# Altium schematic sheet _camera.SchDoc
size Tabloid
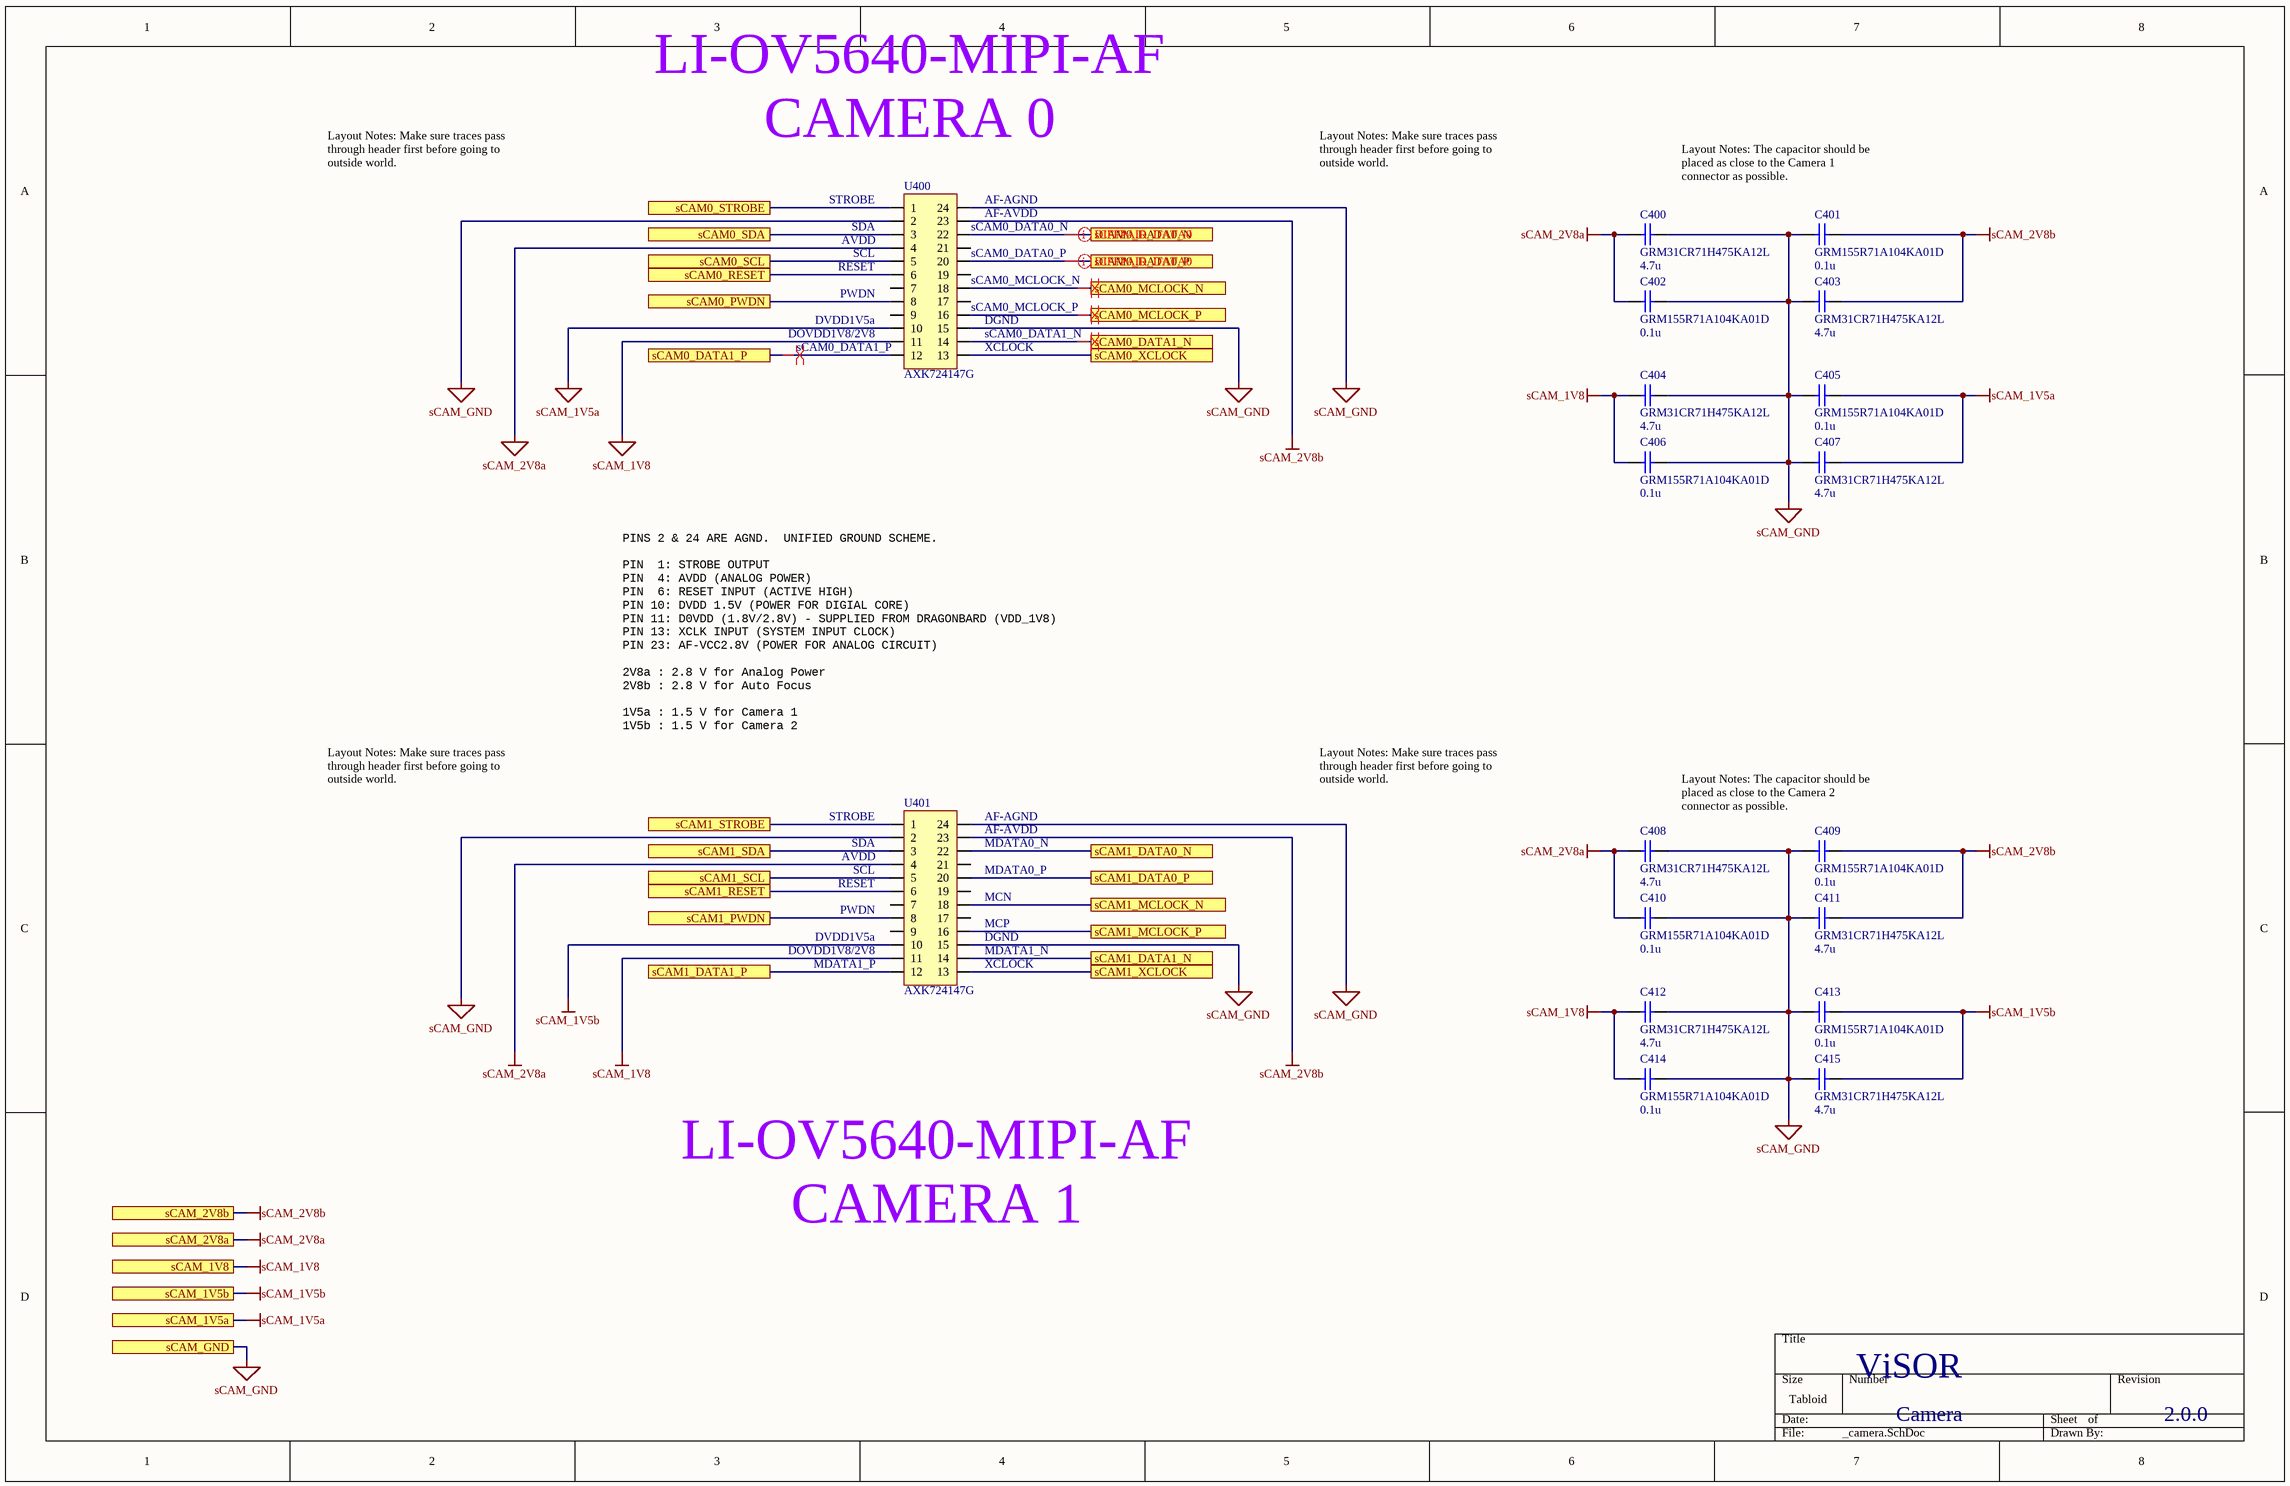
[diagram p0: _camera.SchDoc]

## Parts
C400  GRM31CR71H475KA12L  value 4.7u  [1206]
C401  GRM155R71A104KA01D  value 0.1u  [0402]
C402  GRM155R71A104KA01D  value 0.1u  [0402]
C403  GRM31CR71H475KA12L  value 4.7u  [1206]
C404  GRM31CR71H475KA12L  value 4.7u  [1206]
C405  GRM155R71A104KA01D  value 0.1u  [0402]
C406  GRM155R71A104KA01D  value 0.1u  [0402]
C407  GRM31CR71H475KA12L  value 4.7u  [1206]
C408  GRM31CR71H475KA12L  value 4.7u  [1206]
C409  GRM155R71A104KA01D  value 0.1u  [0402]
C410  GRM155R71A104KA01D  value 0.1u  [0402]
C411  GRM31CR71H475KA12L  value 4.7u  [1206]
C412  GRM31CR71H475KA12L  value 4.7u  [1206]
C413  GRM155R71A104KA01D  value 0.1u  [0402]
C414  GRM155R71A104KA01D  value 0.1u  [0402]
C415  GRM31CR71H475KA12L  value 4.7u  [1206]
U400  AXK724147G  [AXK724147G]
U401  AXK724147G  [AXK724147G]

## Ports
sCAM0_DATA0_N, sCAM0_DATA0_P, sCAM0_DATA1_N, sCAM0_DATA1_P, sCAM0_MCLOCK_N, sCAM0_MCLOCK_P, sCAM0_PWDN, sCAM0_RESET, sCAM0_SCL, sCAM0_SDA, sCAM0_STROBE, sCAM0_XCLOCK, sCAM1_DATA0_N, sCAM1_DATA0_P, sCAM1_DATA1_N, sCAM1_DATA1_P, sCAM1_MCLOCK_N, sCAM1_MCLOCK_P, sCAM1_PWDN, sCAM1_RESET, sCAM1_SCL, sCAM1_SDA, sCAM1_STROBE, sCAM1_XCLOCK, sCAM_1V5a, sCAM_1V5b, sCAM_1V8, sCAM_2V8a, sCAM_2V8b, sCAM_GND

## Nets
sCAM_1V5a: C405.2 C407.1 U400.10 ; port sCAM_1V5a
sCAM_1V5b: C413.2 C415.1 U401.10 ; port sCAM_1V5b
sCAM_1V8: C404.1 C406.2 C412.1 C414.2 U400.11 U401.11 ; port sCAM_1V8
sCAM_2V8a: C400.1 C402.2 C408.1 C410.2 U400.4 U401.4 ; port sCAM_2V8a
sCAM_2V8b: C401.2 C403.1 C409.2 C411.1 U400.23 U401.23 ; port sCAM_2V8b
sCAM_GND: C400.2 C401.1 C402.1 C403.2 C404.2 C405.1 C406.1 C407.2 C408.2 C409.1 C410.1 C411.2 C412.2 C413.1 C414.1 C415.2 U400.2 U400.15 U400.24 U401.2 U401.15 U401.24 ; port sCAM_GND
sCAM0_DATA0_N: U400.22 ; port sCAM0_DATA0_N
sCAM0_DATA0_P: U400.20 ; port sCAM0_DATA0_P
sCAM0_DATA1_N: U400.14 ; port sCAM0_DATA1_N
sCAM0_DATA1_P: U400.12 ; port sCAM0_DATA1_P
sCAM0_MCLOCK_N: U400.18 ; port sCAM0_MCLOCK_N
sCAM0_MCLOCK_P: U400.16 ; port sCAM0_MCLOCK_P
sCAM0_PWDN: U400.8 ; port sCAM0_PWDN
sCAM0_RESET: U400.6 ; port sCAM0_RESET
sCAM0_SCL: U400.5 ; port sCAM0_SCL
sCAM0_SDA: U400.3 ; port sCAM0_SDA
sCAM0_STROBE: U400.1 ; port sCAM0_STROBE
sCAM0_XCLOCK: U400.13 ; port sCAM0_XCLOCK
sCAM1_DATA0_N: U401.22 ; port sCAM1_DATA0_N
sCAM1_DATA0_P: U401.20 ; port sCAM1_DATA0_P
sCAM1_DATA1_N: U401.14 ; port sCAM1_DATA1_N
sCAM1_DATA1_P: U401.12 ; port sCAM1_DATA1_P
sCAM1_MCLOCK_N: U401.18 ; port sCAM1_MCLOCK_N
sCAM1_MCLOCK_P: U401.16 ; port sCAM1_MCLOCK_P
sCAM1_PWDN: U401.8 ; port sCAM1_PWDN
sCAM1_RESET: U401.6 ; port sCAM1_RESET
sCAM1_SCL: U401.5 ; port sCAM1_SCL
sCAM1_SDA: U401.3 ; port sCAM1_SDA
sCAM1_STROBE: U401.1 ; port sCAM1_STROBE
sCAM1_XCLOCK: U401.13 ; port sCAM1_XCLOCK

Not connected (* = marked no-connect by the designer): U400 7 9 17 19 21; U401 7 9 17 19 21

## Layout directives
differential pair: sCAM0_DATA0_N, sCAM0_DATA0_P, sCAM0_DATA1_N, sCAM0_DATA1_P, sCAM0_MCLOCK_N, sCAM0_MCLOCK_P

## Notes on the sheet
- Layout Notes: Make sure traces pass through header first before going to outside world.
- LI-OV5640-MIPI-AF
  CAMERA 0
- (near U400) SDA
- (near U400) STROBE
- (near U400) AF-AGND
- (near U400) AF-AVDD
- Layout Notes: The capacitor should be placed as close to the Camera 1 connector as possible.
- (near U400) AVDD
- (near U400) SCL
- (near U400) RESET
- (near U400) PWDN
- (near U400) DVDD1V5a
- (near U400) DOVDD1V8/2V8
- (near U400) DGND
- (near U400) XCLOCK
- PINS 2 & 24 ARE AGND.  UNIFIED GROUND SCHEME.
  PIN  1: STROBE OUTPUT
  PIN  4: AVDD (ANALOG POWER)
  PIN  6: RESET INPUT (ACTIVE HIGH)
  PIN 10: DVDD 1.5V (POWER FOR DIGIAL CORE)
  PIN 11: D0VDD (1.8V/2.8V) - SUPPLIED FROM DRAGONBARD (VDD_1V8)
  PIN 13: XCLK INPUT (SYSTEM INPUT CLOCK)
  PIN 23: AF-VCC2.8V (POWER FOR ANALOG CIRCUIT)
  2V8a : 2.8 V for Analog Power
  2V8b : 2.8 V for Auto Focus
  1V5a : 1.5 V for Camera 1
  1V5b : 1.5 V for Camera 2
- (near U401) STROBE
- (near U401) AF-AGND
- (near U401) AF-AVDD
- Layout Notes: The capacitor should be placed as close to the Camera 2 connector as possible.
- (near U401) AVDD
- (near U401) SDA
- (near U401) SCL
- (near U401) RESET
- (near U401) MDATA0_N
- (near U401) MDATA0_P
- (near U401) MCN
- (near U401) DVDD1V5a
- (near U401) DOVDD1V8/2V8
- (near U401) MDATA1_P
- (near U401) PWDN
- (near U401) DGND
- (near U401) MDATA1_N
- (near U401) MCP
- (near U401) XCLOCK
- LI-OV5640-MIPI-AF
  CAMERA 1
- ViSOR
- Camera
- 2.0.0

## Library data of the parts
C400 C403 C404 C407 C408 C411 C412 C415 = GRM31CR71HxxxKdddd: -55-125C, 3216, 50V, X7R, ±10%
C401 C402 C405 C406 C409 C410 C413 C414 = GRM155R71AxxxKdddd: -55-125C, 1005, 10V, X7R, ±10%
U400 U401 = AXK724147G: CONN SOCKET P4 .4MM 24POS SMD